# EAGLE schematic test (EAGLE 6.4)
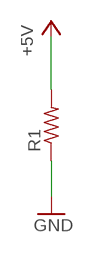
[diagram p0: schematic, sheet 1]

## Parts
R1  R-US_0204/7  [0204/7]

## Nets
GND: R1.1
N$1: R1.2

## Library data of the parts
R1 = rcl:R-US_: RESISTOR, American symbol